# Altium schematic sheet Power.SchDoc
size 513 x 386 mm
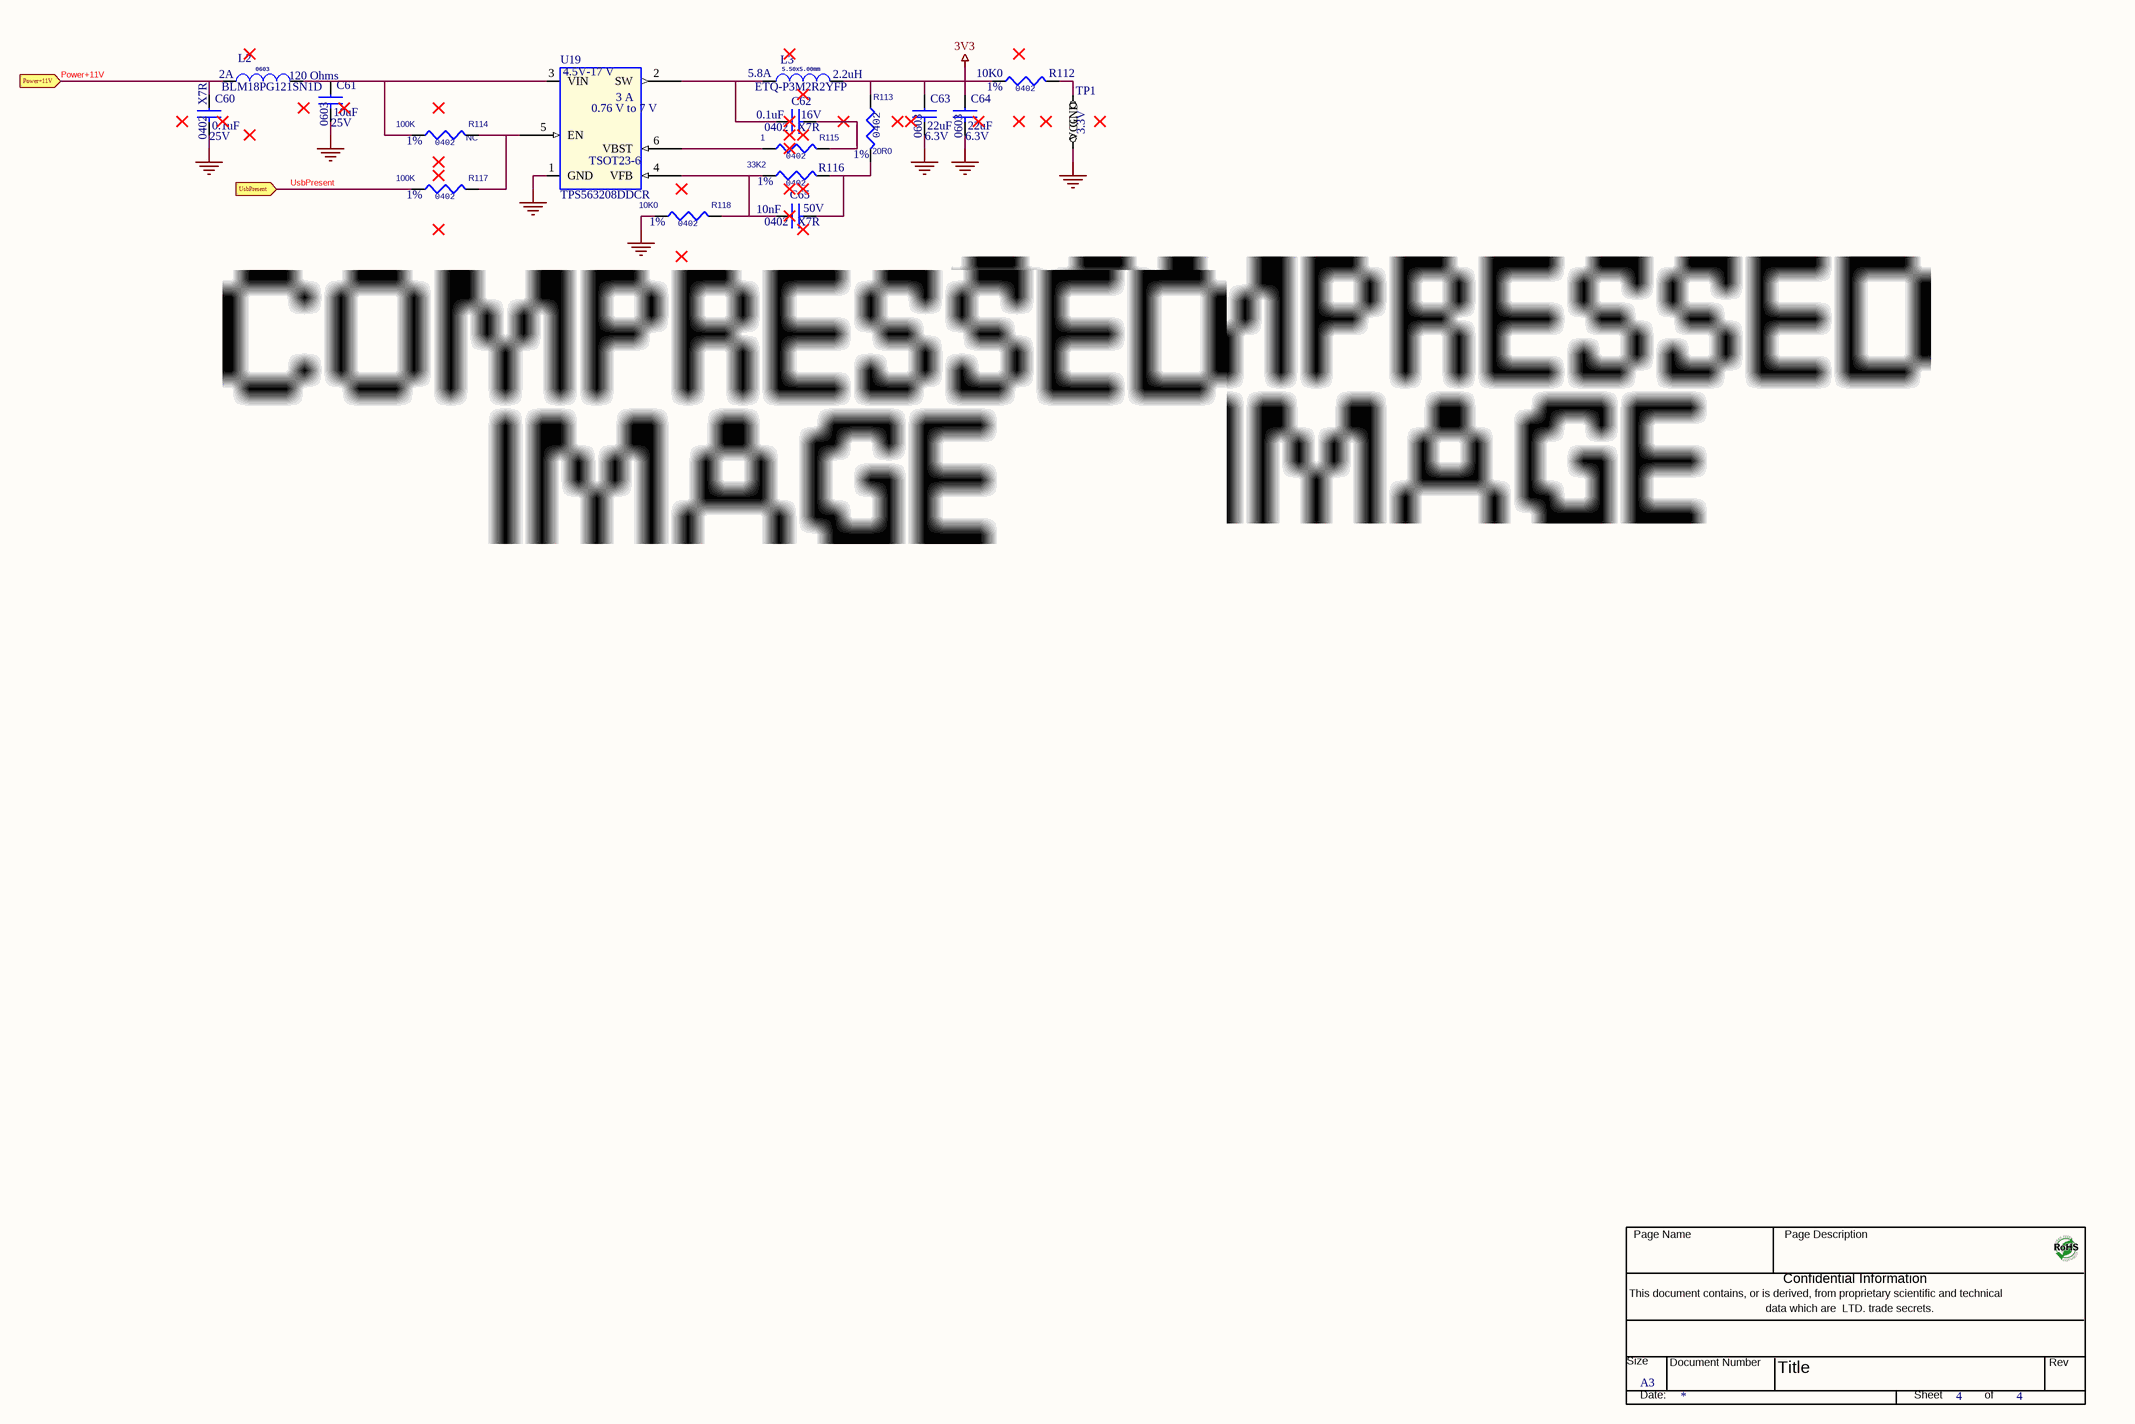
[diagram p0: Power.SchDoc]

## Parts
*  Page Size: A3  Page Number: 4  (hidden comment: MobulusTitleBlockBlank)  (graphical)
C60  0.1uF  TYPE: X7R  VOLTAGE: 25V  [0402]
C61  10uF  VOLTAGE: 25V  [0603]
C62  0.1uF  VOLTAGE: 16V  PCBFootPrint: 0402   X7R  [0402]
C63  22uF  VOLTAGE: 6.3V  [0603]
C64  22uF  VOLTAGE: 6.3V  [0603]
C65  10nF  PCBFootPrint: 0402   X7R  VOLTAGE: 50V  [0402]
L2  BLM18PG121SN1D  Impedance: 120 Ohms  Current: 2A  [L0603]
L3  ETQ-P3M2R2YFP  Inductance: 2.2uH  Current: 5.8A  [ETQ-P3M2R2YFP]
R112  10K0  Tolerance: 1%  [0402]
R113  20R0  Tolerance: 1%  [0402]
R114  100K  Tolerance: 1%  ASSY: NC  [0402]
R115  1  [0402]
R116  33K2  Tolerance: 1%  [0402]
R117  100K  Tolerance: 1%  [0402]
R118  10K0  Tolerance: 1%  [0402]
TP1  Label: 3.3V  [jump2_th5mm]  (hidden comment: TP Power 2 5mm)
U19  TPS563208DDCR  Current: 3 A  OUT_VOLTAGE: 0.76 V to 7 V  PcbFootprint: TSOT23-6  VOLTAGE: 4.5V-17 V  [TSOT23-6_TPS563208DDCR]

## Ports
Power+11V (in), UsbPresent (in)

## Nets
3V3: C64.1
GND: C60.2 C61.2 C63.2 C64.2 R118.1 TP1.2(GND) U19.1(GND)
Power+11V: C60.1 L2.1 ; port Power+11V
UsbPresent: R117.1 ; port UsbPresent
NetC61_1: C61.1 L2.2 R114.1 U19.3(VIN)
NetC62_1: C62.1 L3.1 U19.2(SW)
NetC62_2: C62.2 R115.2
NetC63_1: C63.1 L3.2 R112.1 R113.1
NetC65_1: C65.1 R116.1 R118.2 U19.4(VFB)
NetC65_2: C65.2 R113.2 R116.2
NetR112_2: R112.2 TP1.1(VCC)
NetR114_2: R114.2 R117.2 U19.5(EN)
NetR115_1: R115.1 U19.6(VBST)

## Notes on the sheet
- (in symbol BLM18PG121SN1D) 0603
- (in symbol ETQ-P3M2R2YFP 2.2uH 5.8A) 5.50x5.00mm
- (in symbol MobulusTitleBlockBlank) Page Name; Page Description; Confidential Information; This document contains, or is derived, from proprietary scientific and technical; data which are  LTD. trade secrets.; Size; Document Number; Rev; Title; Date:; Sheet; of
- (in symbol R0402_1R_5%) 0402
- (in symbol R0402_10K0_1%) 0402
- (in symbol R0402_20R0_1%) 0402
- (in symbol R0402_33K2_1%) 0402
- (in symbol R0402_100K_1%) 0402

## Library data of the parts
* = MobulusTitleBlockBlank: Schematic Page Count: 1; Page Create Date: March  8, 1995; Page Count: 4; Page Modify Date: *; Schematic Page Number: 1
C60 = CAP0402_0.1uF 25V: CAP CER 0.1UF 25V X7R 0402; Part Number: GRM155R71E104KE14D; ALT_SYMBOLS: 0402_RND; MFG: Murata Electronics; NO_XNET_CONNECTION: True; OVPN: OVCC00093; PCBFootPrint: 0402; PCB Footprint: 0402
C61 = CAP0603_10uF 25V: CAP CER 10UF 25V X5R 0603; Part Number: CL10A106MA8NRNC; OVPN: OVCC00088; MFG: Samsung Electro-Mechanics; TYPE: X5R; PCBFootPrint: 0603; PCB Footprint: 0603
C62 = CAP0402_0.1uF 16V: CAP_CER_0.1uF_16V_X7R_0402; Part Number: CC0402KRX7R7BB104; NO_XNET_CONNECTION: True; TYPE: X7R; OVPN: OVCC00002; MFG: Yageo; ALT_SYMBOLS_HARD: 0402_RND; ALT_SYMBOLS: 0402_RND; PCB Footprint: 0402
C63 C64 = CAP0603_22uF 6.3V: CAP CER 22UF 6.3V X6S 0603; Part Number: GRM188C80J226ME15D; MFG: Murata Electronics; OVPN: OVCC00080; PCBFootPrint: 0603; TYPE: X6S; PCB Footprint: 0603
C65 = CAP0402_10nF 50V: CAP CER 10000PF 50V X7R 0402; Part Number: CL05B103KB5NNNC; ALT_SYMBOLS: 0402_RND; MFG: Samsung Electro-Mechanics; NO_XNET_CONNECTION: True; OVPN: OVCC00063; TYPE: X7R; PCB Footprint: 0402
L2 = BLM18PG121SN1D: EMI Suppression filter 2A; NO_XNET_CONNECTION: True; OVPN: OVLF00001; MFG: Murata Electronics; PART Number: BLM18PG121SN1D; PCB Footprint: L0603
L3 = ETQ-P3M2R2YFP 2.2uH 5.8A: FIXED IND 2.2UH 5.8A 24.8 MOHM; MFG: Panasonic Electronic Components; OVPN: OVLP00029; PART NUMBER: ETQ-P3M2R2YFP; PCB Footprint: ETQ-P3M2R2YFP
R112 R118 = R0402_10K0_1%: RES SMD 10K OHM 1% 1/16W 0402; Part Number: RC0402FR-0710KL; NO_XNET_CONNECTION: True; OVPN: OVRS00009; MFG: Yageo; Power: 1/16W; MOUNTING: SMT
R113 = R0402_20R0_1%: RES SMD 20 OHM 1% 1/16W 0402; Part Number: RC0402FR-0720RL; OVPN: OVRS00055; NO_XNET_CONNECTION: True; MFG: Yageo; Power: 1/16W; MOUNTING: SMT
R114 R117 = R0402_100K_1%: RES SMD 100K OHM 1% 1/16W 0402; Part Number: RC0402FR-07100KL; NO_XNET_CONNECTION: True; OVPN: OVRS00003; MFG: Yageo; Power: 1/16W; MOUNTING: SMT
R115 = R0402_1R_5%: RES SMD 1R0 5% 1/16W 0402; Part Number: CRGCQ0402J1R0; NO_XNET_CONNECTION: True; OVPN: OVRS00076; MFG: TE Connectivity Passive Product; Current: 1A; Power: 1/16W; MOUNTING: SMT
R116 = R0402_33K2_1%: RES 33K2 1% 1/16W 0402; Part Number: RMCF0402FT33K2; NO_XNET_CONNECTION: True; OVPN: OVRS00131; MFG: Stackpole Electronics Inc; Power: 1/16W; MOUNTING: SMT
TP1 = TP Power 2 5mm: CONN HEADER VERT 2POS 5MM; PART NUMBER: M20-9990246; OVPN: OVJS00023; MFG: Harwin Inc.; ASSY: NC; PCB Footprint: jump2_th5mm
U19 = TPS563208DDCR: IC REG BUCK ADJ 3A TSOT23-6; MFG: Texas Instruments; OVPN: OVIC00130; PART NUMBER: TPS563208DDCR; PCB Footprint: TSOT23-6_TPS563208DDCR